# EAGLE schematic schmtc (EAGLE 9.1.3)
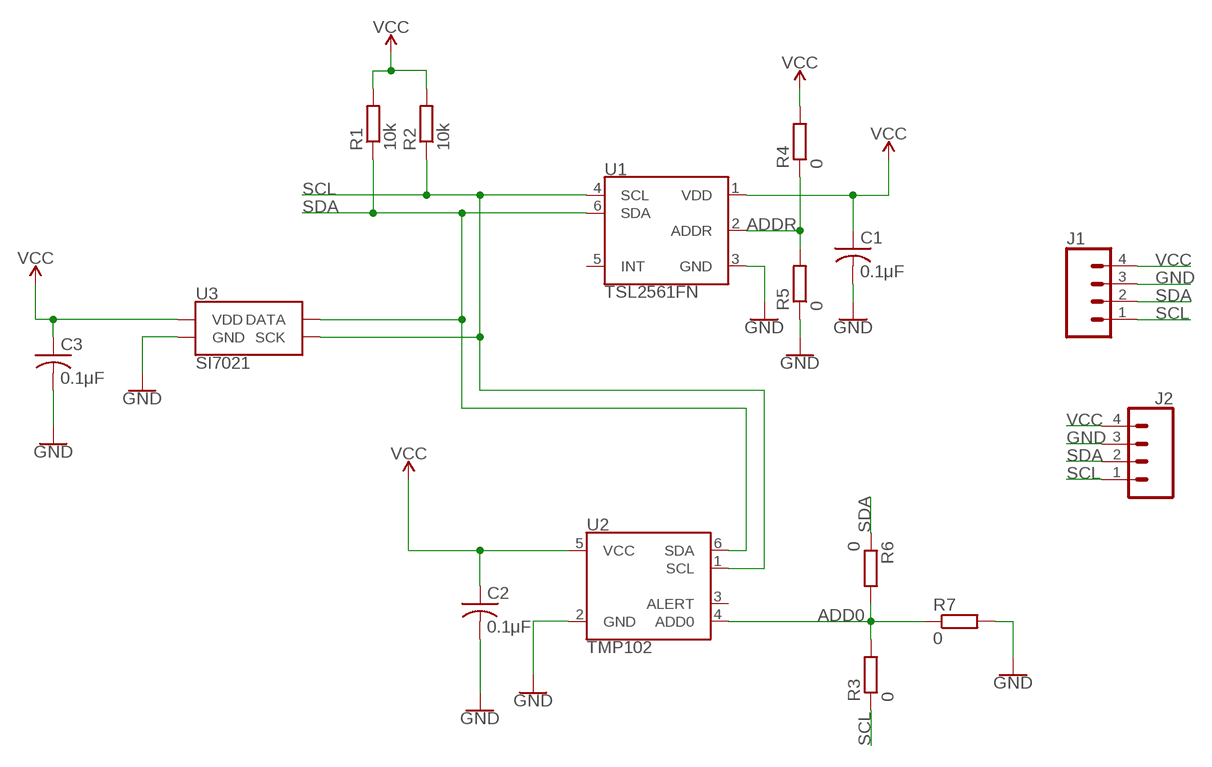
[diagram p0: schematic, sheet 1]

## Parts
C1  0.1μF  C-USC0603  [C0603]
C2  0.1μF  C-USC0603  [C0603]
C3  0.1μF  C-USC0603  [C0603]
J1  CONN_04  [1X04]
J2  CONN_04  [1X04]
R1  10k  R-EU_R0603  [R0603]
R2  10k  R-EU_R0603  [R0603]
R3  0  R-EU_R0603  [R0603]
R4  0  R-EU_R0603  [R0603]
R5  0  R-EU_R0603  [R0603]
R6  0  R-EU_R0603  [R0603]
R7  0  R-EU_R0603  [R0603]
U1  TSL2561FN  [DFN-6-2X2]
U2  TMP102  [SOT563]
U3  SI7021  [DFN-6-3X3-SI7021]

## Nets
ADD0: R3.2 R6.2 R7.1 U2.4(ADD0)
ADDR: R4.1 R5.2 U1.2(ADDR)
GND: C1.2 C2.2 C3.2 J1.3 J2.3 R5.1 R7.2 U1.3(GND) U2.2(GND) U3.GND
SCL: J1.1 J2.1 R2.1 R3.1 U1.4(SCL) U2.1(SCL) U3.SCK
SDA: J1.2 J2.2 R1.1 R6.1 U1.6(SDA) U2.6(SDA) U3.DATA
VCC: C1.1 C2.1 C3.1 J1.4 J2.4 R1.2 R2.2 R4.2 U1.1(VDD) U2.5(VCC) U3.VDD
Unconnected: U1.5(INT) U2.3(ALERT)

## Library data of the parts
C1-C3 = adafruit:C-US: CAPACITOR, American symbol
J1 J2 = SparkFun-Connectors:CONN_04: Multi connection point. Often used as Generic Header-pin footprint for 0.1 inch spaced/style header connections On any of the 0.1 inch spaced packages, you can populate with these: Break Away Headers - Straight <https://www.sparkfun.com/products/116> (PRT-00116) Break Away Male Headers - Right Angle <https://www.sparkfun.com/products/553> (PRT-00553) Female Headers <https://www.sparkfun.com/products/115> (PRT-00115) Break Away Headers - Machine Pin <https://www.sparkfun.com/products/117> (PRT-00117) Break Away Female Headers - Swiss Machine Pin <https://www.sparkfun.com/products/743> (PRT-00743) For SCREWTERMINALS and SPRING TERMINALS visit here: Screw Terimnals on SparkFun.com <https://www.sparkfun.com/search/results?term=Screw+Terminals> (5mm/3.5mm/2.54mm spacing) This device is also useful as a general connection point to wire up your design to another part of your project. Our various solder wires solder well into these plated through hole pads. Hook-Up Wire - Assortment (Stranded, 22 AWG) <https://www.sparkfun.com/products/11375> (PRT-11375) Hook-Up Wire - Assortment (Solid Core, 22 AWG) <https://www.sparkfun.com/products/11367> (PRT-11367) View the entire wire category on our website here <https://www.sparkfun.com/categories/141> Special notes: Molex polarized connector foot print use with SKU : PRT-08231 with associated crimp pins and housings. 1MM SMD Version SKU: PRT-10208; PROD_ID: CONN-09696
R1-R7 = resistor:R-EU_: RESISTOR, European symbol
U1 = SparkFun-Sensors:TSL2561: TAOS TSL2561 Digital Luminosity (Light) Sensor The TSL2561 is a light-to-digital converter that transform light intensity to a digital signal output via I2C interface. The device combines one broadband photodiode (visible plus infrared) and one infrared-responding photodiode on a single CMOS integrated circuit capable of providing a near-photopic response over an effective 20-bit dynamic range (16-bit resolution). Two integrating ADCs convert the photodiode currents to a digital output that represents the irradiance measured on each channel. This digital output can be input to a microprocessor where illuminance (ambient light level) in lux is derived using an empirical formula to approximate the human eye response. The TSL2561 device supports a traditional level style interrupt that remains asserted until the firmware clears it. Datasheet <http://www.mouser.com/ds/2/588/ams_sl2560-e58-488842.pdf> SparkFun Products SparkFun Luminosity Sensor Breakout - TSL2561 <https://www.sparkfun.com/products/12055> (SEN-12055); PROD_ID: IC-11791
U2 = SparkFun-Sensors:TMP102: Texas Instruments TMP102 Low-Power Digital Temperature Sensor The TMP102 is a digital sensor (I2C a.k.a. TWI), has a resolution of 0.0625°C, and is accurate up to 0.5°C. This is a very handy sensor that requires a very low-current. Datasheet <http://www.sparkfun.com/datasheets/Sensors/Temperature/tmp102.pdf> SparkFun Products SparkFun Digital Temperature Sensor Breakout - TMP102 <https://www.sparkfun.com/products/11931> (SEN-11931); PROD_ID: IC-09303
U3 = SparkFun-Sensors:SI7021: Silicon Labs Si7021 I2C Humidity and Temperature Sensor The Si7021 is a low-cost, easy-to-use, highly accurate, digital humidity and temperature sensor. This sensor is ideal for environmental sensing and data logging and perfect for build a weather stations or humidor control system. All you need are two lines for I2C communication, and you’ll have relative humidity readings and very accurate temperature readings as a bonus! Datasheet <https://cdn.sparkfun.com/datasheets/Sensors/Weather/Si7021.pdf> SparkFun Products SparkFun Humidity and Temperature Sensor Breakout - Si7021 <https://www.sparkfun.com/products/13763> (SEN-13763) SparkFun Blynk Board - ESP8266 <https://www.sparkfun.com/products/13794> (WRL-13794); PROD_ID: IC-13093